# Altium schematic sheet Stick.SchDoc
size A4
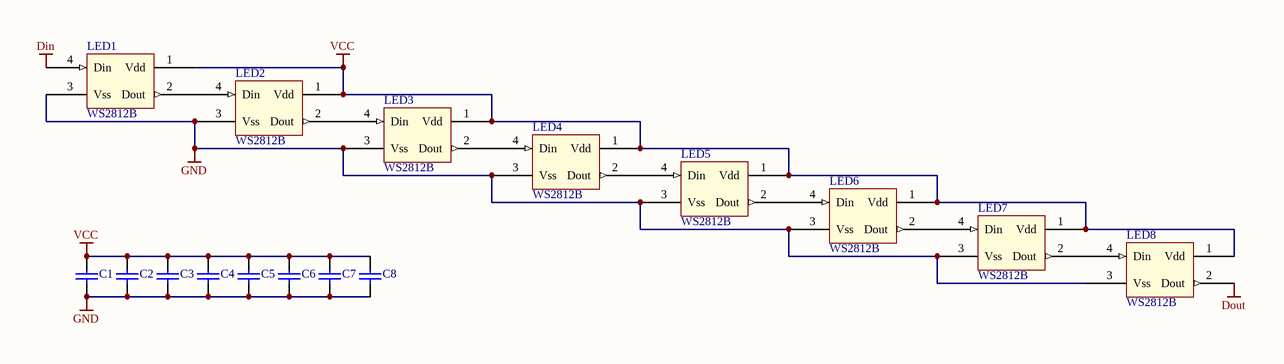
[diagram p0: Stick.SchDoc]

## Parts
C1  (no value)  [C1206]
C2  (no value)  [C1206]
C3  (no value)  [C1206]
C4  (no value)  [C1206]
C5  (no value)  [C1206]
C6  (no value)  [C1206]
C7  (no value)  [C1206]
C8  (no value)  [C1206]
LED1  WS2812B  [WS2812B]
LED2  WS2812B  [WS2812B]
LED3  WS2812B  [WS2812B]
LED4  WS2812B  [WS2812B]
LED5  WS2812B  [WS2812B]
LED6  WS2812B  [WS2812B]
LED7  WS2812B  [WS2812B]
LED8  WS2812B  [WS2812B]

## Nets
Din: LED1.4(Din)
Dout: LED8.2(Dout)
GND: C1.1 C2.1 C3.1 C4.1 C5.1 C6.1 C7.1 C8.1 LED1.3(Vss) LED2.3(Vss) LED3.3(Vss) LED4.3(Vss) LED5.3(Vss) LED6.3(Vss) LED7.3(Vss) LED8.3(Vss)
VCC: C1.2 C2.2 C3.2 C4.2 C5.2 C6.2 C7.2 C8.2 LED1.1(Vdd) LED2.1(Vdd) LED3.1(Vdd) LED4.1(Vdd) LED5.1(Vdd) LED6.1(Vdd) LED7.1(Vdd) LED8.1(Vdd)
NetLED1_2: LED1.2(Dout) LED2.4(Din)
NetLED2_2: LED2.2(Dout) LED3.4(Din)
NetLED3_2: LED3.2(Dout) LED4.4(Din)
NetLED4_2: LED4.2(Dout) LED5.4(Din)
NetLED5_2: LED5.2(Dout) LED6.4(Din)
NetLED6_2: LED6.2(Dout) LED7.4(Din)
NetLED7_2: LED7.2(Dout) LED8.4(Din)

## Library data of the parts
C1-C8 = Cap: Capacitor; Value: 100nF; Published: 8-Jun-2000; LatestRevisionDate: 17-Jul-2002; LatestRevisionNote: Re-released for DXP Platform.; PackageReference: RAD-0.3; Publisher: Altium Limited; PackageDescription: Radial Cap, Thru-Hole; 2 Leads; 0.3 in Pin Spacing